# Altium schematic sheet tesis_page3_power_stage.SchDoc: Power Stage
size A4; Date: 01/04/2021; SheetNumber: 3; SheetTotal: 5
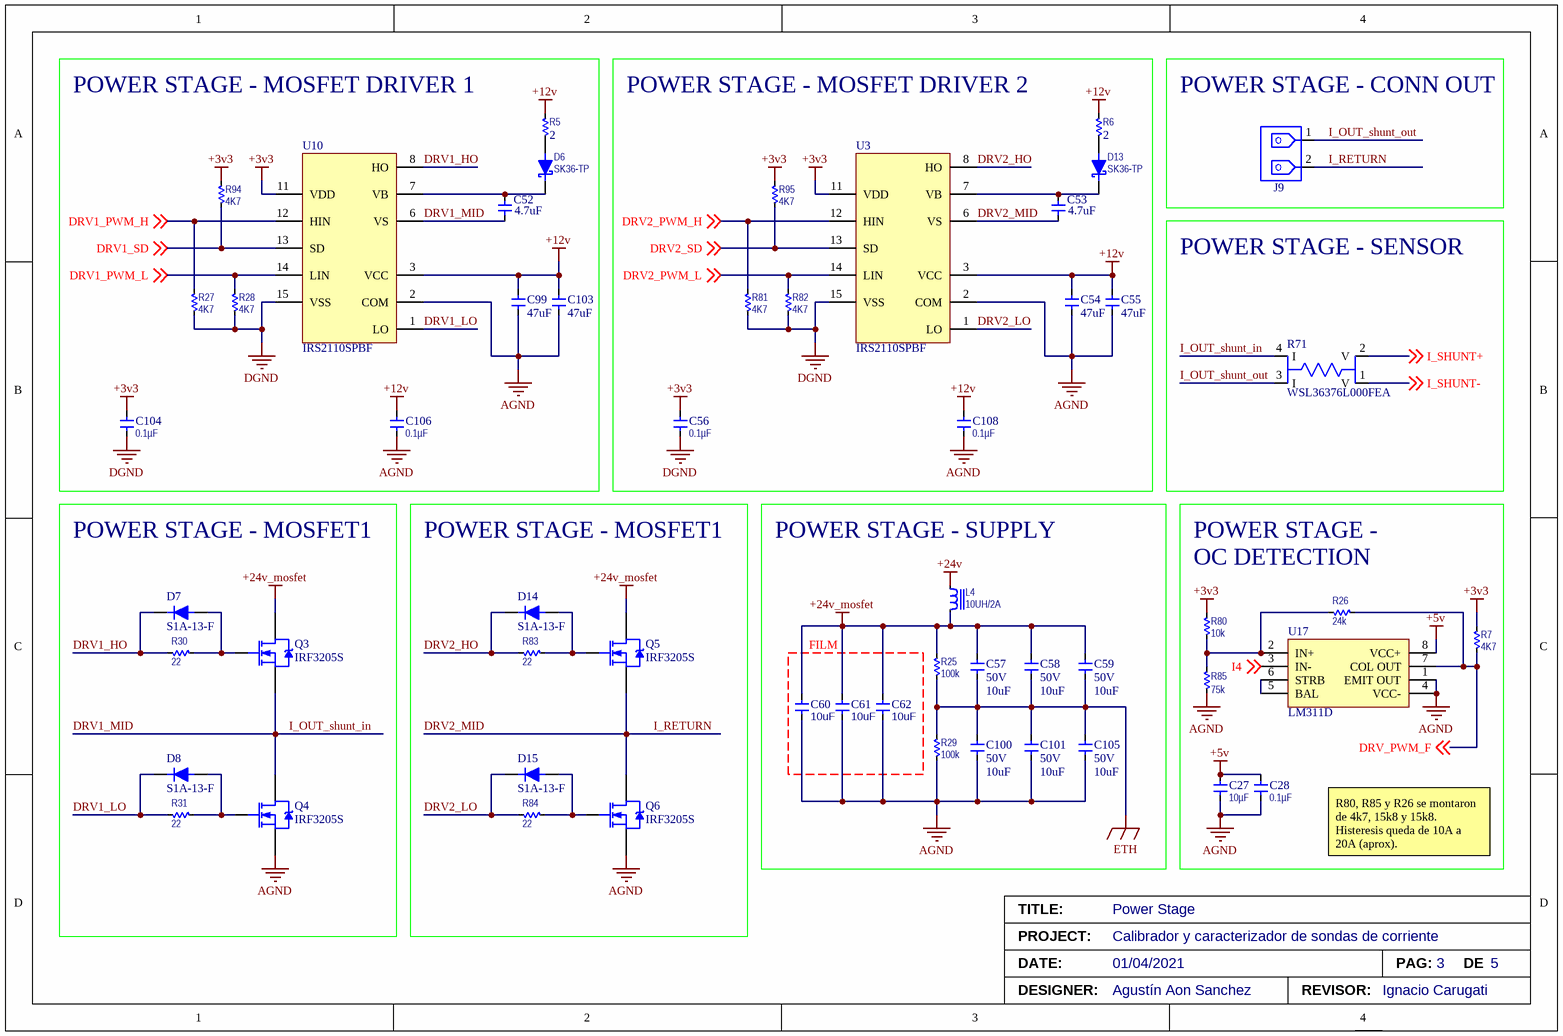
[diagram p0: tesis_page3_power_stage.SchDoc]

## Parts
C27  value 10µF  [CAPC2013X110N]  (hidden comment: CAP_CL21A106KOCL3RC)
C28  value 0.1µF  [CAPC2013X110N]  (hidden comment: CAP_CC0805KRX7R8BB104_YAGEO)
C52  value 4.7uF  [CAPC3216X135N_B]  (hidden comment: CAP_GRM31CR71H475KA12L)
C53  value 4.7uF  [CAPC3216X135N_B]  (hidden comment: CAP_GRM31CR71H475KA12L)
C54  Capacitance: 47uF  [CAPC3216X135N_B]  (hidden comment: CAP_GRM31CR61E476ME44L)
C55  Capacitance: 47uF  [CAPC3216X135N_B]  (hidden comment: CAP_GRM31CR61E476ME44L)
C56  value 0.1µF  [CAPC2013X110N]  (hidden comment: CAP_CC0805KRX7R8BB104_YAGEO)
C57  value 10uF  Voltage Rating: 50V  [CAPC3216X135N_B]  (hidden comment: CAP_GRT31CR61H106ME01L)
C58  value 10uF  Voltage Rating: 50V  [CAPC3216X135N_B]  (hidden comment: CAP_GRT31CR61H106ME01L)
C59  value 10uF  Voltage Rating: 50V  [CAPC3216X135N_B]  (hidden comment: CAP_GRT31CR61H106ME01L)
C60  Capacitance: 10uF  [C180H110]  (hidden comment: CAP_B32754C2106K000)
C61  Capacitance: 10uF  [C180H110]  (hidden comment: CAP_B32754C2106K000)
C62  Capacitance: 10uF  [C180H110]  (hidden comment: CAP_B32754C2106K000)
C99  Capacitance: 47uF  [CAPC3216X135N_B]  (hidden comment: CAP_GRM31CR61E476ME44L)
C100  value 10uF  Voltage Rating: 50V  [CAPC3216X135N_B]  (hidden comment: CAP_GRT31CR61H106ME01L)
C101  value 10uF  Voltage Rating: 50V  [CAPC3216X135N_B]  (hidden comment: CAP_GRT31CR61H106ME01L)
C103  Capacitance: 47uF  [CAPC3216X135N_B]  (hidden comment: CAP_GRM31CR61E476ME44L)
C104  value 0.1µF  [CAPC2013X110N]  (hidden comment: CAP_CC0805KRX7R8BB104_YAGEO)
C105  value 10uF  Voltage Rating: 50V  [CAPC3216X135N_B]  (hidden comment: CAP_GRT31CR61H106ME01L)
C106  value 0.1µF  [CAPC2013X110N]  (hidden comment: CAP_CC0805KRX7R8BB104_YAGEO)
C108  value 0.1µF  [CAPC2013X110N]  (hidden comment: CAP_CC0805KRX7R8BB104_YAGEO)
D6  SK36-TP  [DIOM7959X262N]
D7  S1A-13-F  [DIOM430260X215N]
D8  S1A-13-F  [DIOM430260X215N]
D13  SK36-TP  [DIOM7959X262N]
D14  S1A-13-F  [DIOM430260X215N]
D15  S1A-13-F  [DIOM430260X215N]
J9  CON_1714971  [PHOENIX_1714971]  (value not drawn)
L4  value 10UH/2A  [MAG_INDUCTOR2A]  (hidden comment: MAG_SRR1005-100M_BOURNS)
Q3  IRF3205S  [FP-PG-TO263-3-MFG]
Q4  IRF3205S  [FP-PG-TO263-3-MFG]
Q5  IRF3205S  [FP-PG-TO263-3-MFG]
Q6  IRF3205S  [FP-PG-TO263-3-MFG]
R5  value 2  [RES_RCS1206e3_VISHAY]  (hidden comment: RES_RCS12062R00JNEA_VISHAY)
R6  value 2  [RES_RCS1206e3_VISHAY]  (hidden comment: RES_RCS12062R00JNEA_VISHAY)
R7  value 4K7  [RESC2013X065BN]  (hidden comment: RES_RC0805FR-074K7L_YAGEO)
R25  value 100k  [RESC2013X065BN]  (hidden comment: RES_AC0805JR-07100KL_YAGEO)
R26  value 24k  [RESC2013X065BN]  (hidden comment: RES_RC0805FR-0724KL_YAGEO)
R27  value 4K7  [RESC2013X065BN]  (hidden comment: RES_RC0805FR-074K7L_YAGEO)
R28  value 4K7  [RESC2013X065BN]  (hidden comment: RES_RC0805FR-074K7L_YAGEO)
R29  value 100k  [RESC2013X065BN]  (hidden comment: RES_AC0805JR-07100KL_YAGEO)
R30  value 22  [RESC2013X065BN]  (hidden comment: RES_AC0805JR-0722RL_YAGEO)
R31  value 22  [RESC2013X065BN]  (hidden comment: RES_AC0805JR-0722RL_YAGEO)
R71  WSL36376L000FEA  [RES_WSL36376L000FEA]
R80  value 10k  [RESC2013X065BN]  (hidden comment: RES_RC0805FR-0710KL_YAGEO)
R81  value 4K7  [RESC2013X065BN]  (hidden comment: RES_RC0805FR-074K7L_YAGEO)
R82  value 4K7  [RESC2013X065BN]  (hidden comment: RES_RC0805FR-074K7L_YAGEO)
R83  value 22  [RESC2013X065BN]  (hidden comment: RES_AC0805JR-0722RL_YAGEO)
R84  value 22  [RESC2013X065BN]  (hidden comment: RES_AC0805JR-0722RL_YAGEO)
R85  value 75k  [RESC2013X065BN]  (hidden comment: RC0805JR-0775KL)
R94  value 4K7  [RESC2013X065BN]  (hidden comment: RES_RC0805FR-074K7L_YAGEO)
R95  value 4K7  [RESC2013X065BN]  (hidden comment: RES_RC0805FR-074K7L_YAGEO)
U3  IRS2110SPBF  [SOIC127P1030X265-16N]
U10  IRS2110SPBF  [SOIC127P1030X265-16N]
U17  LM311D  [FP-D0008A-MFG]

## Blocks framed on the sheet
POWER STAGE - MOSFET DRIVER 1: C52 C99 C103 C104 C106 D6 R5 R27 R28 R94 U10
POWER STAGE - MOSFET DRIVER 2: C53-C56 C108 D13 R6 R81 R82 R95 U3
POWER STAGE - CONN OUT: J9
POWER STAGE - SENSOR: R71
POWER STAGE - MOSFET1: D7 D8 Q3 Q4 R30 R31
POWER STAGE - MOSFET1: D14 D15 Q5 Q6 R83 R84
POWER STAGE - SUPPLY: C57-C59 C100 C101 C105 L4 R25 R29
FILM: C60-C62

## Nets
+3v3: C56.1(T1) C104.1(T1) R7.2(T2) R80.2(T2) R94.2(T2) R95.2(T2) U3.11(VDD) U10.11(VDD)
+5v: C27.2(T2) C28.2(T2) U17.8(VCC+)
+12v: C54.2(T2) C55.2(T2) C99.2(T2) C103.2(T2) C106.1(T1) C108.1(T1) R5.2(T2) R6.2(T2) U3.3(VCC) U10.3(VCC)
+24v: L4.1
+24v_mosfet: C57.1(T1) C58.1(T1) C59.1(T1) C60.1(T1) C61.1(T1) C62.1(T1) L4.2 Q3.2(D) Q5.2(D) R25.2(T2)
AGND: C27.1(T1) C28.1(T1) C54.1(T1) C55.1(T1) C60.2(T2) C61.2(T2) C62.2(T2) C99.1(T1) C100.2(T2) C101.2(T2) C103.1(T1) C105.2(T2) C106.2(T2) C108.2(T2) Q4.3(S) Q6.3(S) R29.1(T1) R85.1(T1) U3.2(COM) U10.2(COM) U17.1(EMIT_OUT) U17.4(VCC-)
DGND: C56.2(T2) C104.2(T2) R27.1(T1) R28.1(T1) R81.1(T1) R82.1(T1) U3.15(VSS) U10.15(VSS)
ETH: C57.2(T2) C58.2(T2) C59.2(T2) C100.1(T1) C101.1(T1) C105.1(T1) R25.1(T1) R29.2(T2)
DRV1_HO: D7.1(K) R30.1(T1) U10.8(HO)
DRV1_LO: D8.1(K) R31.1(T1) U10.1(LO)
DRV1_MID: C52.2(T2) Q3.3(S) Q4.2(D) R71.4(I) U10.6(VS)  [also labelled I_OUT_shunt_in]
DRV1_PWM_H: R27.2(T2) U10.12(HIN) ; off-sheet DRV1_PWM_H
DRV1_PWM_L: R28.2(T2) U10.14(LIN) ; off-sheet DRV1_PWM_L
DRV1_SD: R94.1(T1) U10.13(SD) ; off-sheet DRV1_SD
DRV2_HO: D14.1(K) R83.1(T1) U3.8(HO)
DRV2_LO: D15.1(K) R84.1(T1) U3.1(LO)
DRV2_MID: C53.2(T2) J9.2 Q5.3(S) Q6.2(D) U3.6(VS)  [also labelled I_RETURN]
DRV2_PWM_H: R81.2(T2) U3.12(HIN) ; off-sheet DRV2_PWM_H
DRV2_PWM_L: R82.2(T2) U3.14(LIN) ; off-sheet DRV2_PWM_L
DRV2_SD: R95.1(T1) U3.13(SD) ; off-sheet DRV2_SD
DRV_PWM_F: R7.1(T1) R26.1(T1) U17.7(COL_OUT) ; off-sheet DRV_PWM_F
I4: U17.3(IN-) ; off-sheet I4
I_OUT_shunt_out: J9.1 R71.3(I)
I_SHUNT+: R71.2(V) ; off-sheet I_SHUNT+
I_SHUNT-: R71.1(V) ; off-sheet I_SHUNT-
NetC52_1: C52.1(T1) D6.1(K) U10.7(VB)
NetC53_1: C53.1(T1) D13.1(K) U3.7(VB)
NetD6_2: D6.2(A) R5.1(T1)
NetD7_2: D7.2(A) Q3.1(G) R30.2(T2)
NetD8_2: D8.2(A) Q4.1(G) R31.2(T2)
NetD13_2: D13.2(A) R6.1(T1)
NetD14_2: D14.2(A) Q5.1(G) R83.2(T2)
NetD15_2: D15.2(A) Q6.1(G) R84.2(T2)
NetR26_2: R26.2(T2) R80.1(T1) R85.2(T2) U17.2(IN+)
NetU17_5: U17.5(BAL) U17.6(STRB)

## Notes on the sheet
- POWER STAGE -
- OC DETECTION
- R80, R85 y R26 se montaron de 4k7, 15k8 y 15k8. Histeresis queda de 10A a 20A (aprox).
- TITLE:
- PROJECT:
- DATE:
- DESIGNER:
- Calibrador y caracterizador de sondas de corriente
- 01/04/2021
- Agustín Aon Sanchez
- REVISOR:
- Ignacio Carugati
- PAG:
- DE

## Library data of the parts
C27 = CAP_CL21A106KOCL3RC: CAP CER 10UF 16V X5R 0805; Manufacturer: Samsung; Tolerance: 10%; Voltage Rating: 16V; Manufacturer Part Number: CL21A106KOCL3RC; Supplier 1: Future Electronics; RoHS: Yes; Category: Ceramic Capacitors; Stock 1: 3934; Pricing 1: 1=0,10400, 50=0,08230, 100=0,07900, 500=0,07190, 1500=0,06740 (USD); Mount: Surface Mount; Case/Package: 0805; Case Code (Metric): 2012; Case Code (Imperial): 0805; Min Operating Temperature: -55°C; Max Operating Temperature: 85°C; Package Quantity: 1; Packaging: Tape and Reel; Length: 0.079inch; Width: 0.049inch; Thickness: 0.037inch; ComponentLink1URL: https://datasheet.ciiva.com/25796/cl21a106kocl3rc-25796224.pdf?src-supplier=Digi-Key; ComponentLink1Description: https://datasheet.ciiva.com/25796/cl21a106kocl3rc-25796224.pdf?src-supplier=Digi-Key; Supplier Part Number 1: 8109145; Capacitance: 10µF
C28 C56 C104 C106 C108 = CAP_CC0805KRX7R8BB104_YAGEO: CAP CER 0.1UF 25V 10% X7R 0805; Manufacturer: Yageo; Supplier: *; Tolerance: 10%; Power Rating: *; Voltage Rating: 25V; BOM Populate: *; Digikey Part Number: 311-1141-1-ND; Mouser Part Number: 603-CC805KRX7R8BB104; Manufacturer Part Number: CC0805KRX7R8BB104
C52 C53 = CAP_GRM31CR71H475KA12L: 1206 4.7 uF 50 V ±10% Tolerance X7R SMT Multilayer Ceramic Capacitor; Manufacturer: Murata; Voltage Rating: 50V; Tolerance: 10%; Manufacturer Part Number: GRM31CR71H475KA12L; Supplier 1: Newark; Supplier Part Number 1: 24R6347; Category: Ceramic Capacitors; Mount: Surface Mount; Case/Package: 1206; Case Code (Metric): 3216; Case Code (Imperial): 1206; Material: Ceramic; Min Operating Temperature: -55°C; Max Operating Temperature: 125°C; Packaging: Tape and Reel; Dielectric: X7R; Package Quantity: 2000; Series: GRM; Voltage Rating (DC): 50V; Construction: Flat; Termination: SMD/SMT; Voltage: 50V; Length: 3.2mm; Width: 0.063inch; Height: 1.6mm; Depth: 1.6mm; Thickness: 0.071inch; Radiation Hardening: No; RoHS Compliant: Yes; Lead Free: Lead Free; REACH SVHC: No SVHC; ComponentLink1URL: https://datasheet.ciiva.com/6072/415379-6072784.pdf?src-supplier=Farnell; ComponentLink1Description: https://datasheet.ciiva.com/6072/415379-6072784.pdf?src-supplier=Farnell; ComponentLink2URL: https://datasheet.ciiva.com/3777/2267grm31cr71h475ka1223-3777241.pdf?src-supplier=Arrow+Electronics; ComponentLink2Description: https://datasheet.ciiva.com/3777/2267grm31cr71h475ka1223-3777241.pdf?src-supplier=Arrow+Electronics; ComponentLink3URL: https://datasheet.ciiva.com/29202/450972-da-01-de-vs-chip-kond-1206-4-7-uf-10pr-50-0v-x7r-29202576.pdf?src-supplier=Conrad; ComponentLink3Description: https://datasheet.ciiva.com/29202/450972-da-01-de-vs-chip-kond-1206-4-7-uf-10pr-50-0v-x7r-29202576.pdf?src-supplier=Conrad; ComponentLink4URL: https://datasheet.ciiva.com/29202/451279-da-01-de-vs-kondens-grm31-cr71h-475ka12l-29202365.pdf?src-supplier=Conrad; ComponentLink4Description: https://datasheet.ciiva.com/29202/451279-da-01-de-vs-kondens-grm31-cr71h-475ka12l-29202365.pdf?src-supplier=Conrad; ComponentLink5URL: https://datasheet.ciiva.com/7937/415310-7937749.pdf?src-supplier=Element14; ComponentLink5Description: https://datasheet.ciiva.com/7937/415310-7937749.pdf?src-supplier=Element14; ComponentLink6URL: https://datasheet.ciiva.com/6270/partnumbering-e-01-6270219.pdf?src-supplier=Digi-Key; ComponentLink6Description: https://datasheet.ciiva.com/6270/partnumbering-e-01-6270219.pdf?src-supplier=Digi-Key; ComponentLink7URL: https://datasheet.ciiva.com/6270/partnumbering-e-01-6270217.pdf?src-supplier=Digi-Key; ComponentLink7Description: https://datasheet.ciiva.com/6270/partnumbering-e-01-6270217.pdf?src-supplier=Digi-Key; ComponentLink8URL: https://datasheet.ciiva.com/6270/partnumbering-e-01-6270218.pdf?src-supplier=Digi-Key; ComponentLink8Description: https://datasheet.ciiva.com/6270/partnumbering-e-01-6270218.pdf?src-supplier=Digi-Key
C54 C55 C99 C103 = CAP_GRM31CR61E476ME44L: CAP CER 47UF 25V X5R 1206; Manufacturer: Murata; Tolerance: 20%; Supplier 1: Digi-Key; Supplier Part Number 1: 490-16268-2-ND; Manufacturer Part Number: GRM31CR61E476ME44L; RoHS: Yes; Category: Ceramic Capacitors; Stock 1: 122000; Pricing 1: 2000=0,37770, 4000=0,35816 (USD); Voltage Rating (DC): 25V; Dielectric: X5R; Length: 3.2mm; Width: 1.6mm; Thickness: 1.6mm; ComponentLink1URL: https://search.murata.co.jp/Ceramy/image/img/A01X/partnumbering_e_01.pdf?src-supplier=Digi-Key; ComponentLink1Description: https://search.murata.co.jp/Ceramy/image/img/A01X/partnumbering_e_01.pdf?src-supplier=Digi-Key
C57-C59 C100 C101 C105 = CAP_GRT31CR61H106ME01L: Cap Ceramic 10uF 50V X5R 20% Pad SMD 1206 85C Automotive T/R; Manufacturer: Murata; Supplier 1: Digi-Key; Manufacturer Part Number: GRT31CR61H106ME01L; RoHS: Yes; Category: Ceramic Capacitors; Stock 1: 575627; Pricing 1: 1=0,46000, 10=0,31800, 50=0,22240, 100=0,19060, 500=0,14294, 1000=0,12070 (USD); Mount: Surface Mount; Case/Package: 1206; Case Code (Metric): 3216; Case Code (Imperial): 1206; Min Operating Temperature: -55°C; Max Operating Temperature: 85°C; Packaging: Tape and Reel; Tolerance: 20%; Length: 0.126inch; Width: 0.063inch; Thickness: 0.071inch; Ratings: AEC-Q200; RoHS Compliant: Yes; ComponentLink1URL: http://search.murata.co.jp/Ceramy/image/img/A01X/G101/ENG/GRT31CR61H106ME01-01.pdf?src-supplier=Digi-Key; ComponentLink1Description: http://search.murata.co.jp/Ceramy/image/img/A01X/G101/ENG/GRT31CR61H106ME01-01.pdf?src-supplier=Digi-Key; Supplier Part Number 1: 490-12457-1-ND
C60-C62 = CAP_B32754C2106K000: Cap Film 10uF 500V PP 10% (31.5 X 22 X 36.5mm) Dipped Radial 27.5mm 105°C Bulk; Manufacturer: TDK EPCOS; Voltage Rating (AC): 250V; ESR (Equivalent Series Resistance): 4.2mR; Supplier 1: Digi-Key; Manufacturer Part Number: B32754C2106K000; RoHS: No; Category: Film Capacitors; Stock 1: 338; Pricing 1: 1=5,13000, 10=4,62000, 50=4,00380, 100=3,49040, 500=2,87448, 1000=2,78648 (USD); Mount: Through Hole; Case/Package: Radial; Dielectric Material: PP; Min Operating Temperature: -40°C; Max Operating Temperature: 105°C; Packaging: Bulk; Tolerance: 10%; Voltage Rating (DC): 500V; Termination: PC Pins; RoHS Compliant: No; ComponentLink1URL: https://en.tdk.eu/inf/20/20/ds/MKP_B32754_758.pdf?src-supplier=Digi-Key; ComponentLink1Description: https://en.tdk.eu/inf/20/20/ds/MKP_B32754_758.pdf?src-supplier=Digi-Key; Supplier Part Number 1: 495-76101-ND
D6 D13 = DIO_SK36_MICROCOM: DIODE SCHOTTKY 60V 3A SMC; Manufacturer: Micro Commercial Co; Digikey Part Number: SK36-TPMSCT-ND; Manufacturer Part Number: SK36-TP; Mouser Part Number: 833-SK36-TP
D7 D8 D14 D15 = DIO_S1A-13-F_DI: DIODE GEN PURP 50V 1A SMA; Manufacturer: Diodes Incorporated; Digikey Part Number: S1A-FDICT-ND; Manufacturer Part Number: S1A-13-F; Mouser Part Number: 621-S1A-F
J9 = CON_1714971: Large Style 2pos 32a 500vac 24-10awg Green Plastic Interlocking Housing 9.5.0mm Pitch; Manufacturer: Phoenix Contact; Number of Levels: 1; Number of Positions Per Level: 2; Current: 30A; Voltage: 600V; Wire Gauge (Max): 24AWG; Wire Gauge (Min): 10AWG; Voltage Rating: 1kV; Max Supply Voltage: 690V; Connector Type: PCB,Terminal Block; Gender: Male; Pitch: 0.375inch; Stripping Length: 8mm; Approvals: UL,CSA,cULus,EAC; Supplier 1: Digi-Key; Supplier Part Number 1: 277-1271-ND; Manufacturer Part Number: 1714971; Category: Test Probes, Leads and Clips; Mount: Through Hole; Color: Green; Housing Material: Polyamide; Packaging: Bulk; Termination: Screw; ComponentLink1URL: https://datasheet.ciiva.com/16071/1714971-16071957.pdf?src-supplier=Onlinecomponents.com; ComponentLink1Description: https://datasheet.ciiva.com/16071/1714971-16071957.pdf?src-supplier=Onlinecomponents.com; Number of Pins: 2; Weight: 0.228928oz; Housing Color: Green; Insulation Material: Nylon; Contact Material: Tin; Material: Polyamide; Number of Poles: 2; Max Current Rating: 32A; Package Quantity: 50; Number of Rows: 1; Current Rating: 32A; Number of Positions: 2; Number of Contacts: 2; Number of Circuits: 2; Orientation: Straight; Series: MKDS; Length: 19.04mm; Width: 21.5mm; Height: 21.5mm; Wire/Cable Gauge: 24AWG; Depth: 12.5mm; Radiation Hardening: No; Lead Free: Lead Free; Flammability Rating: UL94 V-0; RoHS Compliant: Yes; REACH SVHC: No SVHC; ComponentLink2URL: https://datasheet.ciiva.com/823/1714971-823798.pdf?src-supplier=Digi-Key; ComponentLink2Description: https://datasheet.ciiva.com/823/1714971-823798.pdf?src-supplier=Digi-Key; ComponentLink3URL: https://datasheet.ciiva.com/15169/getdatasheetpartid-177884-15169654.pdf?src-supplier=Verical; ComponentLink3Description: https://datasheet.ciiva.com/15169/getdatasheetpartid-177884-15169654.pdf?src-supplier=Verical; ComponentLink4URL: https://datasheet.ciiva.com/1118/100944-1118424.pdf?src-supplier=Element14; ComponentLink4Description: https://datasheet.ciiva.com/1118/100944-1118424.pdf?src-supplier=Element14; ComponentLink5URL: https://datasheet.ciiva.com/29218/744593-da-01-en-printklemme-mkds-5-2-9-5-29218293.pdf?src-supplier=Conrad; ComponentLink5Description: https://datasheet.ciiva.com/29218/744593-da-01-en-printklemme-mkds-5-2-9-5-29218293.pdf?src-supplier=Conrad
L4 = MAG_SRR1005-100M_BOURNS: FIXED IND 10UH 2A 65 MOHM SMD; Manufacturer: Bourns Inc; BOM Populate: *; Current Rating: *; Supplier: *; Supplier Part No: *; Digikey Part Number: SRR1005-100MCT-ND; Voltage Rating: *; Tolerance: *; Manufacturer Part Number: SRR1005-100M; Mouser Part Number: 652-SRR1005-100M
Q3-Q6 = MSC_IRF3205STRLPBF: INFINEON         IRF3205STRLPBF             MOSFET Transistor, N Channel, 110 A, 55 V, 0.008 ohm, 10 V, 4 V; Drain to Source Voltage (Vdss): 55V; Continuous Drain Current (ID): 110A; Rds On Max: 8mR; Input Capacitance: 3.247nF; Max Power Dissipation: 200W; Gate to Source Voltage (Vgs): 20V; Turn-Off Delay Time: 50ns; Turn-On Delay Time: 14ns; Threshold Voltage: 4V; Supplier 1: Digi-Key; Supplier Part Number 1: IRF3205STRLPBFCT-ND; Manufacturer: Infineon; Manufacturer Part Number: IRF3205STRLPBF; RoHS: Yes; Stock 1: 754; Pricing 1: 1=1,74000, 10=1,42600, 25=1,39920, 100=1,10880 (USD); Mount: Surface Mount; Case/Package: D2PAK; Min Operating Temperature: -55°C; Max Operating Temperature: 175°C; Packaging: Cut Tape; ComponentLink1URL: https://www.alliedelec.com/m/d/b8827ca43655240244f0cc5c2198e6b1.pdf?src-supplier=Allied+Electronics; ComponentLink1Description: https://www.alliedelec.com/m/d/b8827ca43655240244f0cc5c2198e6b1.pdf?src-supplier=Allied+Electronics; Category: MOSFETs; Number of Pins: 3; Power Dissipation: 200W; Drain to Source Breakdown Voltage: 55V; Drain to Source Resistance: 8mR; Max Dual Supply Voltage: 55V; Length: 0.42inch; Width: 0.38inch; Height: 0.19inch; Lead Free: Contains Lead; REACH SVHC: No SVHC; Halogen Free: Halogen Free; ComponentLink2URL: http://www.infineon.com/dgdl/irf3205spbf.pdf?fileId=5546d462533600a4015355defac9190c&src-supplier=Digi-Key; ComponentLink2Description: http://www.infineon.com/dgdl/irf3205spbf.pdf?fileId=5546d462533600a4015355defac9190c&src-supplier=Digi-Key; ComponentLink3URL: http://www.farnell.com/datasheets/1884183.pdf?src-supplier=Element14; ComponentLink3Description: http://www.farnell.com/datasheets/1884183.pdf?src-supplier=Element14; ComponentLink4URL: https://www.infineon.com/dgdl/irf3205spbf.pdf?fileId=5546d462533600a4015355defac9190c&src-supplier=Digi-Key; ComponentLink4Description: https://www.infineon.com/dgdl/irf3205spbf.pdf?fileId=5546d462533600a4015355defac9190c&src-supplier=Digi-Key
R5 R6 = RES_RCS12062R00JNEA_VISHAY: RES SMD 2 OHM 5% 1/2W 1206 ANTI SURGE; Manufacturer: Vishay; Supplier 1: Digi-Key; Supplier Part Number 1: 541-10617-1-ND; Manufacturer Part Number: RCS12062R00JNEA; RoHS: No; Category: Chip SMD Resistors; Stock 1: 9930; Pricing 1: 1=0,26000, 10=0,22300, 100=0,08730, 1000=0,03654, 2500=0,03350 (USD)
R7 R27 R28 R81 R82 R94 R95 = RES_RC0805FR-074K7L_YAGEO: RES SMD 4.7K OHM 1% 1/8W 0805; Manufacturer: Yageo; BOM Populate: *; Supplier Part No: *; Supplier: *; Digikey Part Number: 311-4.70KCRCT-ND; Power Rating: 1/8W; Manufacturer Part Number: RC0805FR-074K7L; Mouser Part Number: 603-RC0805FR-074K7L; Tolerance: 1%
R25 R29 = RES_AC0805JR-07100KL_YAGEO: RES SMD 100K OHM 5% 1/8W 0805; Manufacturer: Yageo; BOM Populate: *; Supplier Part No: *; Supplier: *; Tolerance: 5%; Digikey Part Number: YAG3756CT-ND; Power Rating: 1/8W; Manufacturer Part Number: AC0805JR-07100KL; Mouser Part Number: 603-AC0805JR-07100KL
R26 = RES_RC0805FR-0724KL_YAGEO: RES SMD 24K OHM 1% 1/8W 0805; Manufacturer: Yageo; Tolerance: 1%; Digikey Part Number: 311-24.0KCRCT-ND; Power Rating: 1/8W; Manufacturer Part Number: RC0805FR-0724KL; Mouser Part Number: 603-RC0805FR-0724KL
R30 R31 R83 R84 = RES_AC0805JR-0722RL_YAGEO: RES SMD 22 OHM 5% 1/8W 0805; Manufacturer: Yageo; Tolerance: 5%; BOM Populate: *; Supplier Part No: *; Supplier: *; Digikey Part Number: 311-22ARCT-ND; Power Rating: 1/8W; Manufacturer Part Number: AC0805JR-0722RL; Mouser Part Number: 603-AC0805JR-0722RL
R71 = WSL36376L000FEA: WSL Series 3637 3 W 0.006 Ohm ±1% ±50 ppm/°C SMT Power Metal Strip® Resistor; Manufacturer: Vishay Dale; Power Rating: 3W; Value: 6mR; Supplier 1: Digi-Key; Supplier Part Number 1: WSLI-.006CT-ND; Manufacturer Part Number: WSL36376L000FEA; Category: Chip SMD Resistors; Case/Package: 3637; Case Code (Metric): 9194; Case Code (Imperial): 3637; Min Operating Temperature: -65°C; Max Operating Temperature: 170°C; Termination: SMD/SMT; Temperature Coefficient: 50ppm/°C; Packaging: Tape and Reel; Package Quantity: 4000; Tolerance: 1%; Resistor Type: Metal Strip; Length: 9.14mm; Width: 9.4mm; Height: 0.635mm; ComponentLink1URL: https://datasheet.ciiva.com/9064/wsl3637-9064007.pdf?src-supplier=Avnet; ComponentLink1Description: https://datasheet.ciiva.com/9064/wsl3637-9064007.pdf?src-supplier=Avnet; ComponentLink2URL: https://datasheet.ciiva.com/17193/wsl3637-17193820.pdf?src-supplier=Avnet+Europe; ComponentLink2Description: https://datasheet.ciiva.com/17193/wsl3637-17193820.pdf?src-supplier=Avnet+Europe; ComponentLink3URL: https://datasheet.ciiva.com/16215/wsl3637-16215263.pdf?src-supplier=Future+Electronics; ComponentLink3Description: https://datasheet.ciiva.com/16215/wsl3637-16215263.pdf?src-supplier=Future+Electronics; Contact Plating: Tin; Weight: 0.010229oz; Size Code: 3637; Max Power Dissipation: 3W; Features: Moisture Resistant,Automotive AEC-Q200,Anti-Sulfur; Series: WSL; Number of Terminations: 4; Radiation Hardening: No; Lead Free: Lead Free; RoHS Compliant: Yes
R80 = RES_RC0805FR-0710KL_YAGEO: RES SMD 10K OHM 1% 1/8W 0805; Manufacturer: Yageo; BOM Populate: *; Supplier Part No: *; Supplier: *; Digikey Part Number: 311-10.0KCRCT-ND; Power Rating: 1/8W; Manufacturer Part Number: RC0805FR-0710KL; Mouser Part Number: 603-RC0805FR-0710KL; Tolerance: 1%
R85 = RC0805JR-0775KL: Res Thick Film 0805 75K Ohm 5% 0.125W(1/8W) ±100ppm/C Molded SMD Paper T/R; Manufacturer: Yageo; Temperature Coefficient: 100ppm/°C; Power Rating: 125mW; Voltage Rating: 150V; Supplier 1: Digi-Key; Supplier Part Number 1: 311-75KARCT-ND; Manufacturer Part Number: RC0805JR-0775KL; Category: Chip SMD Resistors; Case/Package: 0805; Contact Plating: Tin,Matte,Lead; Case Code (Imperial): 0805; Case Code (Metric): 2012; Size Code: 0805; Min Operating Temperature: -55°C; Max Operating Temperature: 155°C; Tolerance: 5%; Resistor Type: Thick Film; Packaging: Tape and Reel; Construction: Rectangular; Termination: SMD/SMT; Series: RC; Number of Terminations: 2; Max Power Dissipation: 125mW; Features: Moisture Resistant; Voltage Rating (DC): 150V; Package Quantity: 1; Length: 2mm; Width: 1.25mm; Height: 0.024inch; Depth: 1.25mm; Radiation Hardening: No; Military Standard: Not; RoHS Compliant: Yes; Lead Free: Lead Free; ComponentLink1URL: https://datasheet.ciiva.com/2519/pyu-r-int-thick-7-2519243.pdf?src-supplier=Digi-Key; ComponentLink1Description: https://datasheet.ciiva.com/2519/pyu-r-int-thick-7-2519243.pdf?src-supplier=Digi-Key; ComponentLink2URL: https://datasheet.ciiva.com/2519/pyu-r-int-thick-7-2519244.pdf?src-supplier=Digi-Key; ComponentLink2Description: https://datasheet.ciiva.com/2519/pyu-r-int-thick-7-2519244.pdf?src-supplier=Digi-Key; ComponentLink3URL: https://datasheet.ciiva.com/17361/rc0805-17361116.pdf?src-supplier=Future+Electronics; ComponentLink3Description: https://datasheet.ciiva.com/17361/rc0805-17361116.pdf?src-supplier=Future+Electronics; ComponentLink4URL: https://datasheet.ciiva.com/2519/pyu-r-int-thick-7-2519245.pdf?src-supplier=Digi-Key; ComponentLink4Description: https://datasheet.ciiva.com/2519/pyu-r-int-thick-7-2519245.pdf?src-supplier=Digi-Key
U3 U10 = IC_IRS2110SPBF: IC,Dual MOSFET Driver,CMOS,SOP,16PIN,PLASTIC; Manufacturer: International Rectifier; Turn-On Delay Time: 10ns; Max Supply Current: 340uA; Max Supply Voltage: 20V; Min Supply Voltage: 10V; Max Power Dissipation: 1.25W; Number of Outputs: 2; Fall Time: 25ns; Release Time: 120ns; Rise Time: 35ns; Propagation Delay: 160ns; Max Output Current: 2.5A; Supplier 1: Digi-Key; Supplier Part Number 1: IRS2110SPBF-ND; Manufacturer Part Number: IRS2110SPBF; RoHS: Yes; Category: MOSFETs; Stock 1: 7235; Pricing 1: 1=2,65000, 10=2,38300, 25=2,24800, 100=1,79840, 250=1,57360, 500=1,52864, 1000=1,21392, 2500=1,16896, 5000=1,12400 (USD); Mount: Surface Mount; Case/Package: SOIC; Number of Pins: 16; Min Operating Temperature: -40°C; Max Operating Temperature: 125°C; Number of Drivers: 2; Turn-Off Delay Time: 10ns; Power Dissipation: 1.25W; Packaging: Rail/Tube; Output Current: 2.5A; Nominal Supply Current: 340uA; Package Quantity: 45; Length: 10.5mm; Width: 7.6mm; Height: 2.35mm; Radiation Hardening: No; REACH SVHC: No SVHC; Lead Free: Lead Free; ComponentLink1URL: https://datasheet.ciiva.com/16298/irs2110-16298887.pdf?src-supplier=Future+Electronics; ComponentLink1Description: https://datasheet.ciiva.com/16298/irs2110-16298887.pdf?src-supplier=Future+Electronics; ComponentLink2URL: https://datasheet.ciiva.com/1950/irs2110-1950490.pdf?src-supplier=Digi-Key; ComponentLink2Description: https://datasheet.ciiva.com/1950/irs2110-1950490.pdf?src-supplier=Digi-Key; ComponentLink3URL: https://datasheet.ciiva.com/1499/57913-1499806.pdf?src-supplier=Element14; ComponentLink3Description: https://datasheet.ciiva.com/1499/57913-1499806.pdf?src-supplier=Element14
U17 = IC_LM311D: Comparator Single 15V/30V 8-Pin SOIC Tube; Manufacturer: Texas Instruments; Max Supply Voltage: 30V; Min Supply Voltage: 3.5V; Min Dual Supply Voltage: 1.75V; Max Dual Supply Voltage: 15V; Number of Channels: 1; Input Offset Voltage (Vos): 7.5mV; Response Time: 165ns; Quiescent Current: 7.5mA; Input Bias Current: 250nA; Voltage Gain: 106.02dB; Output Type: TTL; Output Current: 50mA; Operating Supply Voltage: 28V; Dual Supply Voltage: 9V; Supplier 1: Digi-Key; Supplier Part Number 1: 296-1388-5-ND; Manufacturer Part Number: LM311D; Category: Amplifiers - Op Amps, Buffer, Instrumentation; Mount: Surface Mount; Case/Package: SOIC; Number of Pins: 8; Weight: 0.002561oz; Min Operating Temperature: 0°C; Max Operating Temperature: 70°C; Packaging: Rail/Tube; Package Quantity: 75; Number of Elements: 1; Nominal Supply Current: 7.5mA; Max Supply Current: 7.5mA; Type: General Purpose; Max Input Current: 250nA; Output Current per Channel: 50mA; Termination: SMD/SMT; Length: 4.9mm; Width: 3.91mm; Height: 1.58mm; Radiation Hardening: No; Lead Free: Lead Free; RoHS Compliant: Yes; REACH SVHC: No SVHC